# EAGLE schematic ranback_bottom (EAGLE 9.6.2)
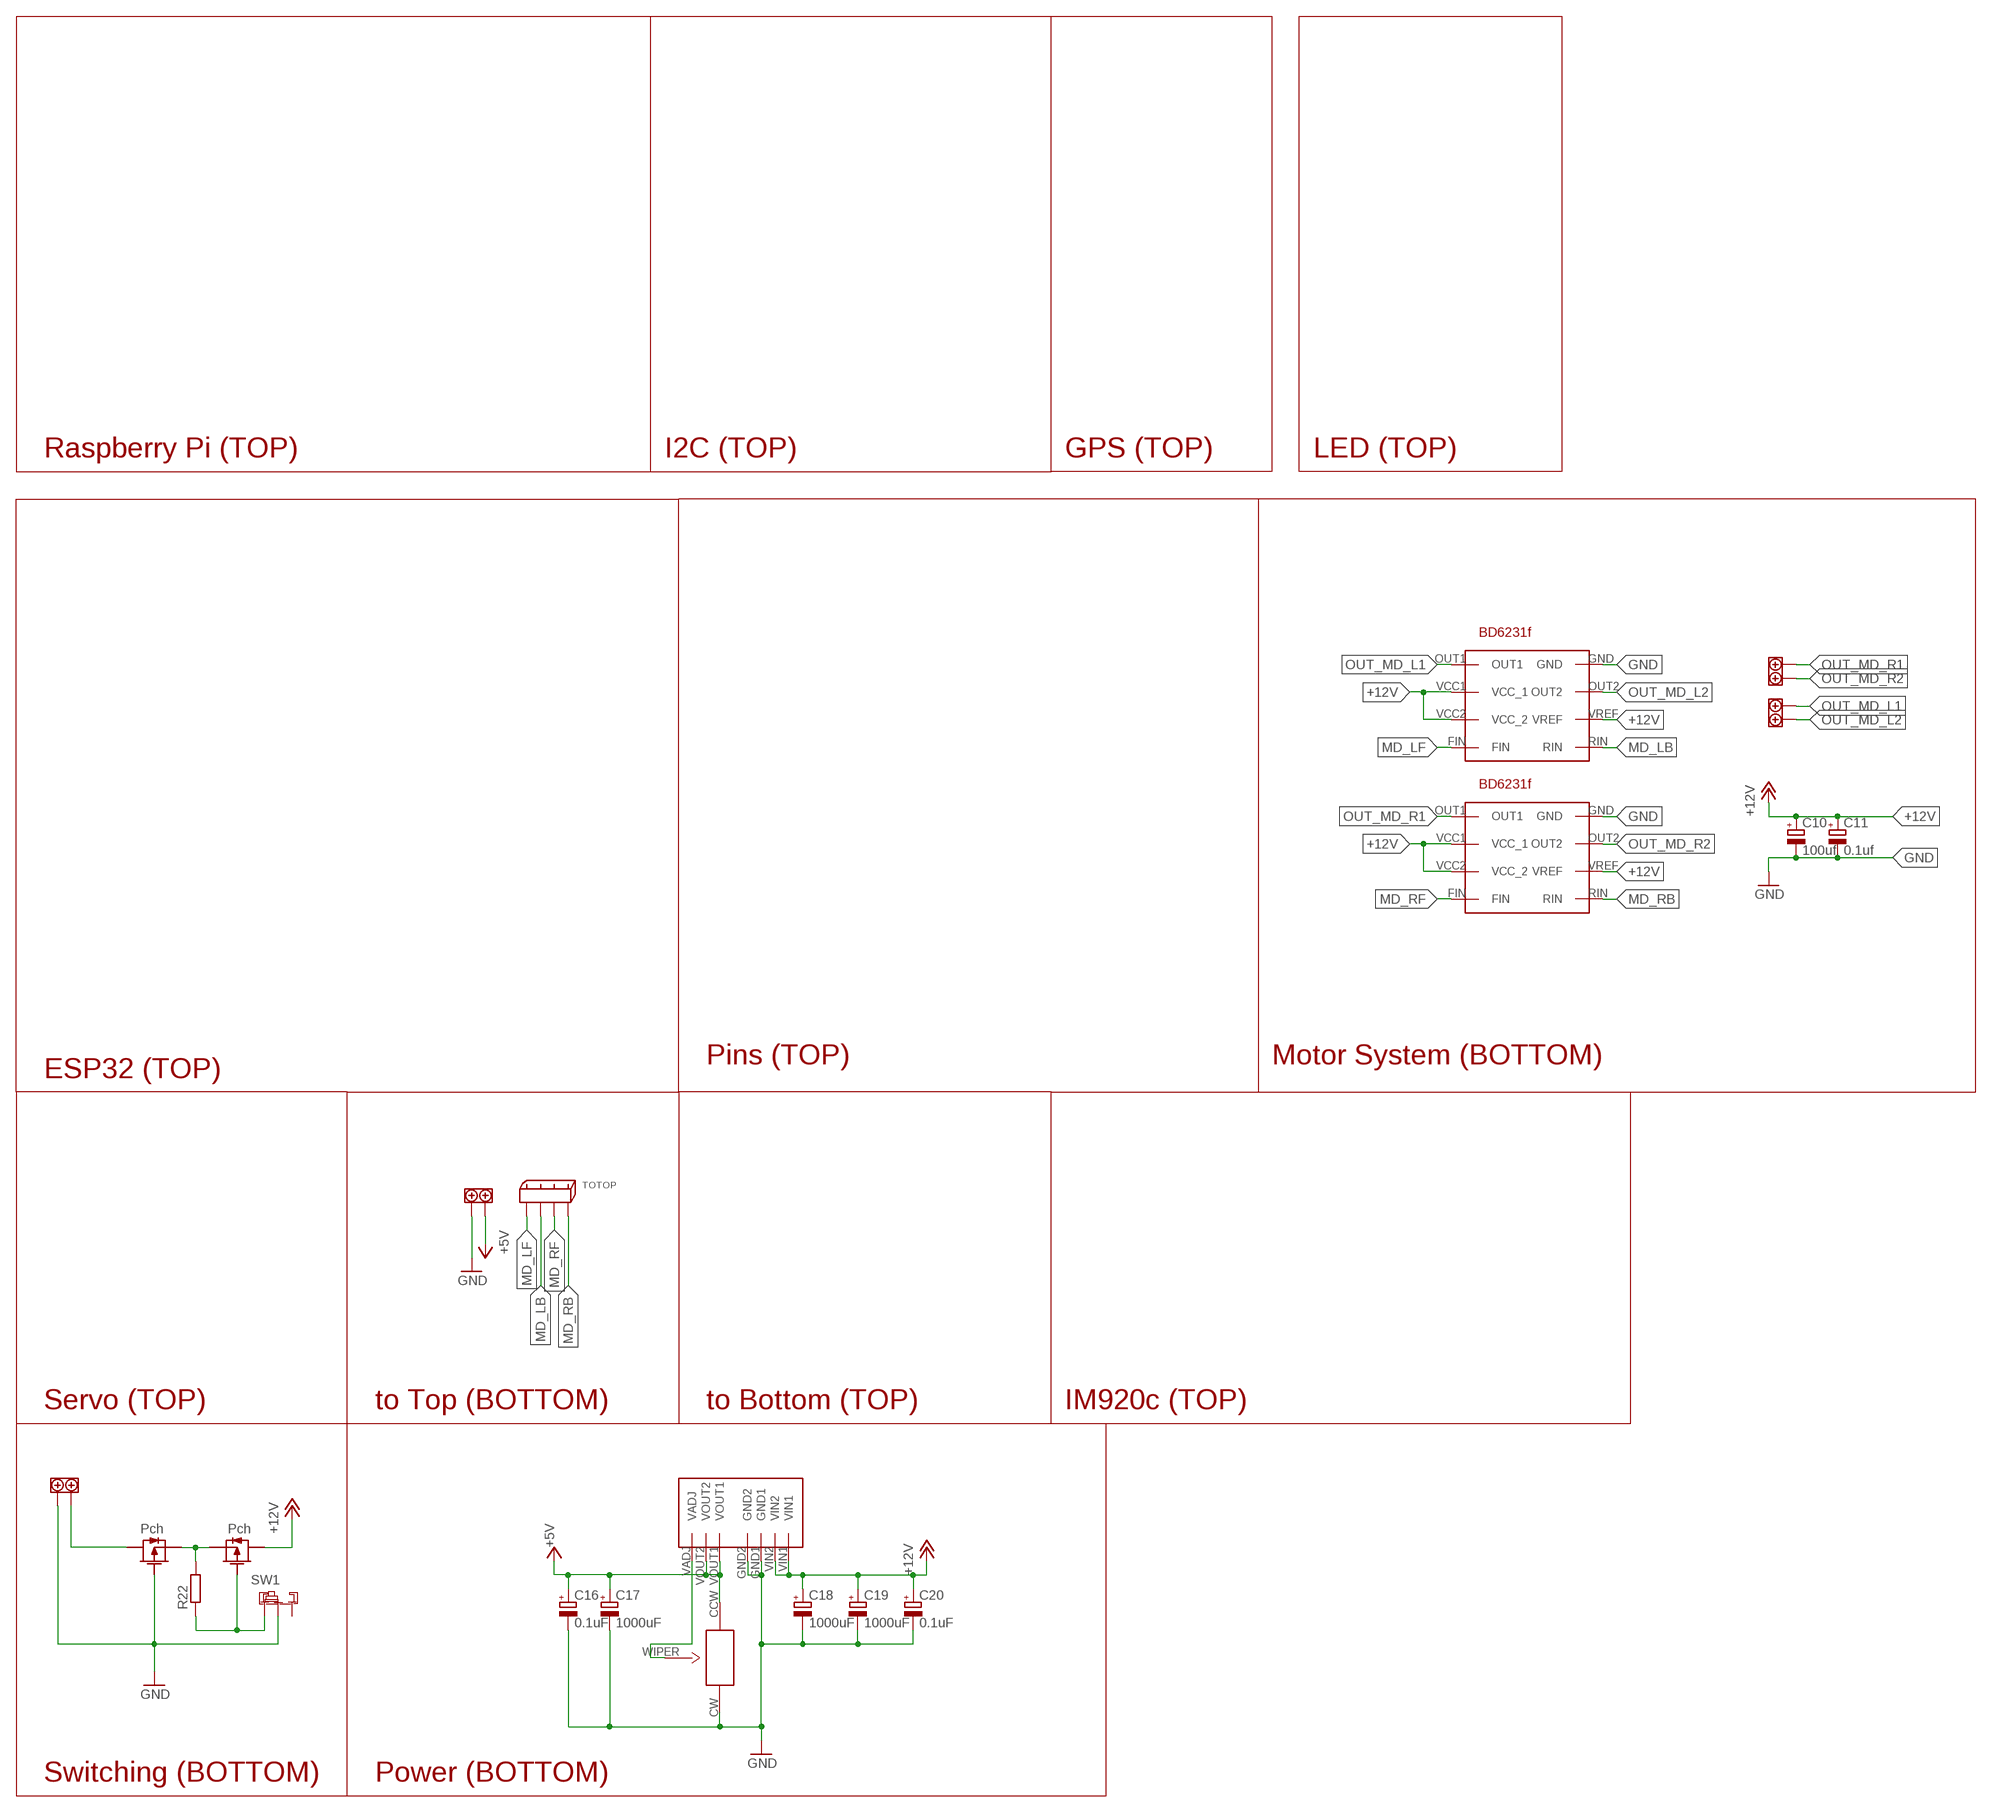
[diagram p0: schematic, sheet 1]

## Parts
100KR1  100kR  3362P  [3362P]
C10  100uf  CPOL-EUE2.5-7  [E2,5-7]
C11  0.1uf  CPOL-EUE2.5-7  [E2,5-7]
C16  0.1uF  CPOL-EUE2.5-7  [E2,5-7]
C17  1000uF  CPOL-EUE5-10.5  [E5-10,5]
C18  1000uF  CPOL-EUE5-10.5  [E5-10,5]
C19  1000uF  CPOL-EUE5-10.5  [E5-10,5]
C20  0.1uF  CPOL-EUE2.5-7  [E2,5-7]
MD_L  BD6231F  [BD6231F]
MD_R  BD6231F  [BD6231F]
R22  R-EU_0207/10  [0207/10]
SW1  SRIDE_SWITCH  [SRIDE_SWITCH]
TM1  TERMINAL_SLOPED_2PIN  [TERMINAL_SLOPED_2PIN]
TM2  TERMINAL_SLOPED_2PIN  [TERMINAL_SLOPED_2PIN]
TM3  TERMINAL_SLOPED_2PIN  [TERMINAL_SLOPED_2PIN]
TM4  TERMINAL_SLOPED_2PIN  [TERMINAL_SLOPED_2PIN]
TOTOP  2.5_MINI-SPOX_4PIN  [2.5_MINI-SPOX_4PIN]
U$7  2SJ681-PCH  [2SJ681]
U$8  5V3A_KIC-053  [5V3A_KIC-053]
U$10  2SJ681-PCH  [2SJ681]

## Nets
+5V: 100KR1.CCW C16.+ C17.+ TM4.1 U$8.VOUT1 U$8.VOUT2
+12V: C10.+ C11.+ C18.+ C19.+ C20.+ MD_L.VCC1(VCC_1) MD_L.VCC2(VCC_2) MD_L.VREF MD_R.VCC1(VCC_1) MD_R.VCC2(VCC_2) MD_R.VREF U$8.VIN1 U$8.VIN2 U$10.DRAIN
A7_1: R22.2 U$7.SOURCE U$10.SOURCE
GND: 100KR1.CW C10.- C11.- C16.- C17.- C18.- C19.- C20.- MD_L.GND MD_R.GND SW1.LR TM3.2 TM4.2 U$7.GATE U$8.GND1 U$8.GND2
MD_LB: MD_L.RIN TOTOP.P$2
MD_LF: MD_L.FIN TOTOP.P$1
MD_RB: MD_R.RIN TOTOP.P$4
MD_RF: MD_R.FIN TOTOP.P$3
N$9: TM3.1 U$7.DRAIN
N$18: 100KR1.WIPER U$8.VADJ
N$20: R22.1 SW1.L U$10.GATE
OUT_MD_L1: MD_L.OUT1 TM2.1
OUT_MD_L2: MD_L.OUT2 TM2.2
OUT_MD_R1: MD_R.OUT1 TM1.1
OUT_MD_R2: MD_R.OUT2 TM1.2
Unconnected: SW1.R

## Notes on the sheet
- Raspberry Pi (TOP) | I2C (TOP) | GPS (TOP) | LED (TOP)
- Pins (TOP) | Motor System (BOTTOM)
- ESP32 (TOP)
- Servo (TOP) | to Top (BOTTOM) | to Bottom (TOP) | IM920c (TOP)
- Switching (BOTTOM) | Power (BOTTOM)

## Library data of the parts
100KR1 = TRIM_register:3362P
C10 C11 C16-C20 = rcl:CPOL-EU: POLARIZED CAPACITOR, European symbol; SPICEPREFIX: C
MD_L MD_R = Motor Driver:BD6231F
R22 = rcl:R-EU_: RESISTOR, European symbol; SPICEPREFIX: R
SW1 = Switches:SRIDE_SWITCH
TM1-TM4 = TerminalBrock:TERMINAL_SLOPED_2PIN
TOTOP = Connector:2.5_MINI-SPOX_4PIN
U$7 U$10 = mosfet:2SJ681-PCH
U$8 = DC-DC:5V3A_KIC-053